# EAGLE schematic dci (EAGLE 9.0.0)

## Sheet 1 of 2
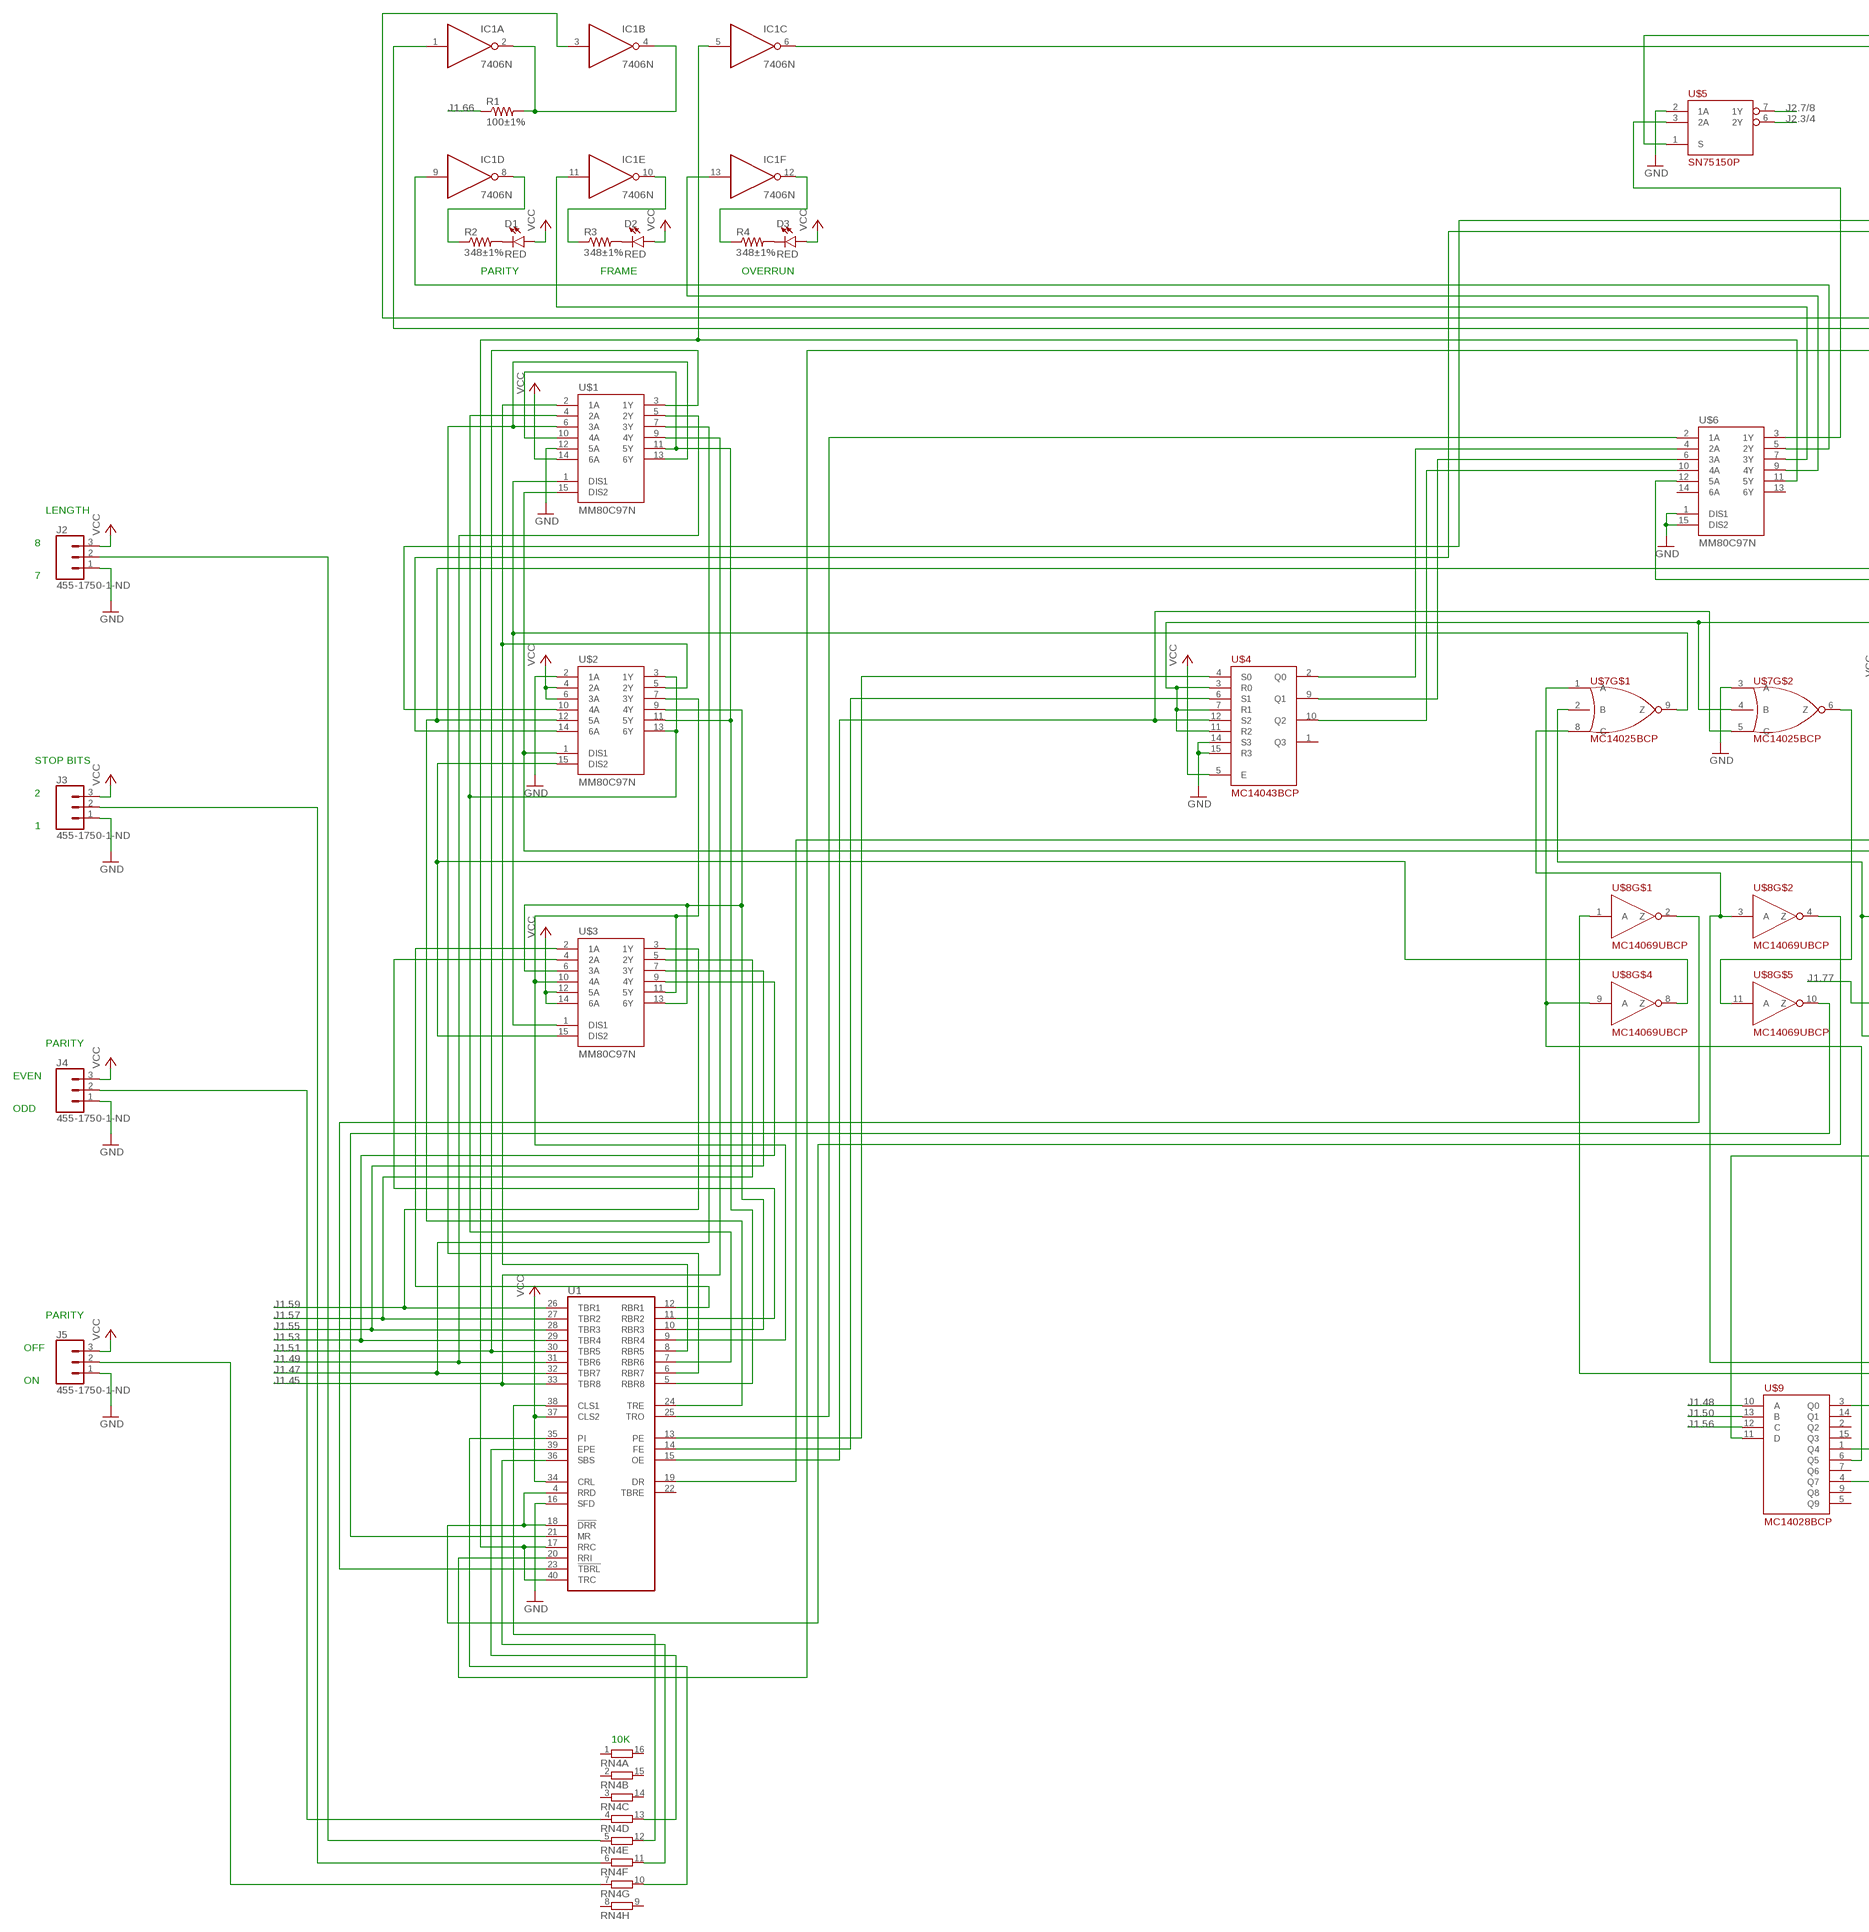
[diagram p0: schematic, sheet 1, part 1 of 2]
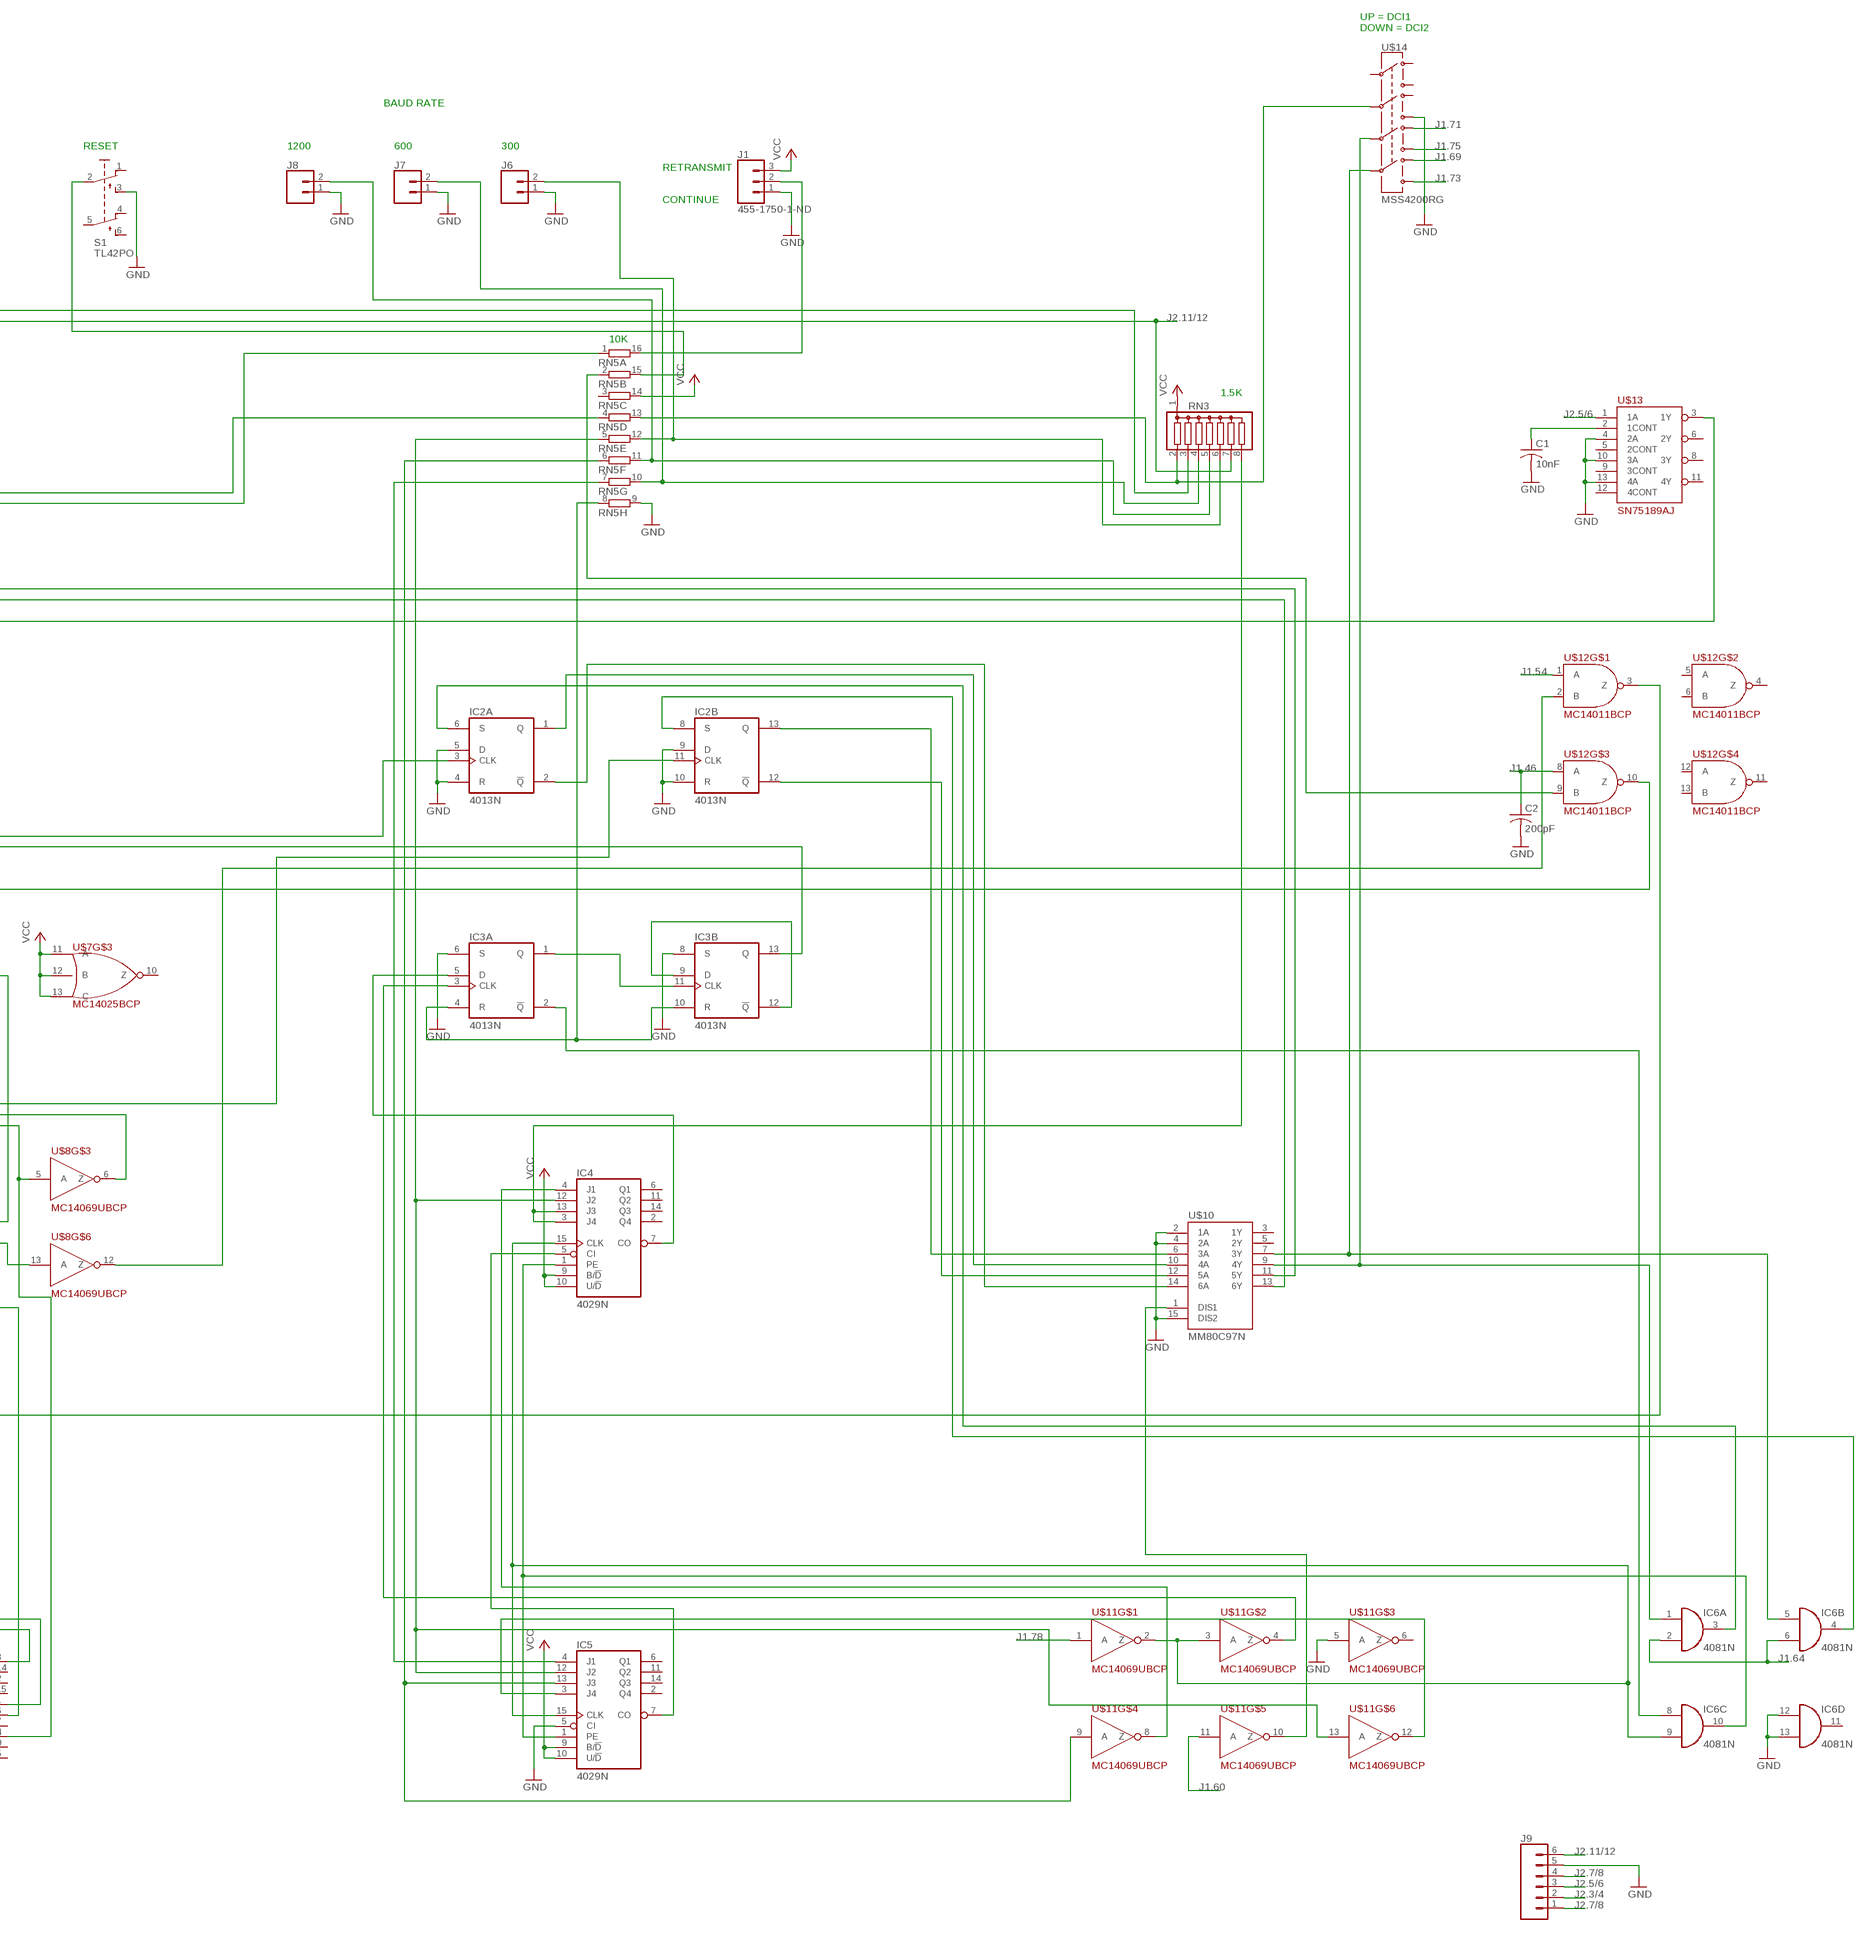
[diagram p1: schematic, sheet 1, part 2 of 2]

### Parts
C1  10nF  C-US050-024X044  [C050-024X044]
C2  200pF  C-US050-024X044  [C050-024X044]
D1  RED  LED3MM  [LED_3MM]
D2  RED  LED3MM  [LED_3MM]
D3  RED  LED3MM  [LED_3MM]
IC1  7406N  [DIL14]
IC2  4013N  [DIL14]
IC3  4013N  [DIL14]
IC4  4029N  [DIL16]
IC5  4029N  [DIL16]
IC6  4081N  [DIL14]
J1  455-1750-1-ND  CONN_03  [1X03]
J2  455-1750-1-ND  CONN_03  [1X03]
J3  455-1750-1-ND  CONN_03  [1X03]
J4  455-1750-1-ND  CONN_03  [1X03]
J5  455-1750-1-ND  CONN_03  [1X03]
J6  CONN_02  [1X02]
J7  CONN_02  [1X02]
J8  CONN_02  [1X02]
J9  CONN_06SILK_FEMALE_PTH  [1X06]
R1  100±1%  R-US_0207/7  [0207/7]
R2  348±1%  R-US_0207/7  [0207/7]
R3  348±1%  R-US_0207/7  [0207/7]
R4  348±1%  R-US_0207/7  [0207/7]
RN3  G07R  [SIL8]
RN4  8R-N  [DIL16]
RN5  8R-N  [DIL16]
S1  TL42PO  [TL4XPO]
U1  HD6402  [DIL40]
U$1  MM80C97N  [DIL16]
U$2  MM80C97N  [DIL16]
U$3  MM80C97N  [DIL16]
U$4  MC14043BCP  [DIL16]
U$5  SN75150P  [DIL08]
U$6  MM80C97N  [DIL16]
U$7  MC14025BCP  [DIL14]
U$8  MC14069UBCP  [DIL14]
U$9  MC14028BCP  [DIL16]
U$10  MM80C97N  [DIL16]
U$11  MC14069UBCP  [DIL14]
U$12  MC14011BCP  [DIL14]
U$13  SN75189AJ  [DIL14]
U$14  MSS4200RG  [MSS4200RG]

### Nets
GND: C1.2 C2.2 IC2.4(A:R) IC2.5(A:D) IC2.9(B:D) IC2.10(B:R) IC3.6(A:S) IC3.8(B:S) IC5.5(CI) IC6.12(D:I0) IC6.13(D:I1) J1.1 J2.1 J3.1 J4.1 J5.1 J6.1 J7.1 J8.1 J9.5 RN5.9 S1.3(S) U1.16(SFD) U$1.12(5A) U$2.2(1A) U$4.14(S3) U$4.15(R3) U$5.2(1A) U$6.1(DIS1) U$6.15(DIS2) U$7.3(A) U$10.2(1A) U$10.4(2A) U$10.15(DIS2) U$11.5(A) U$13.4(2A) U$13.10(3A) U$13.13(4A) U$14.6 ; also sheet 2
J1.45: U1.33(TBR8) U$1.9(4Y)
J1.46: C2.1 U$12.8(A)
J1.47: U1.32(TBR7) U$1.7(3Y)
J1.48: U$9.10(A)
J1.49: U1.31(TBR6) U$1.5(2Y)
J1.50: U$9.13(B)
J1.51: U1.30(TBR5) U$1.3(1Y)
J1.53: U1.29(TBR4) U$3.9(4Y)
J1.54: U$12.1(A)
J1.55: U1.28(TBR3) U$3.7(3Y)
J1.56: U$9.12(C)
J1.57: U1.27(TBR2) U$3.5(2Y)
J1.59: U1.26(TBR1) U$3.3(1Y)
J1.60: U$11.11(A)
J1.64: IC6.2(A:I1) IC6.6(B:I1)
J1.66: R1.1
J1.69: U$14.10
J1.71: U$14.7
J1.73: U$14.12
J1.75: U$14.9
J1.77: U$8.13(A)
J1.78: U$11.1(A)
J2.3/4: J9.2 U$5.6(2Y) ; also sheet 2
J2.5/6: J9.3 U$13.1(1A) ; also sheet 2
J2.7/8: J9.1 J9.4 U$5.7(1Y) ; also sheet 2
J2.11/12: IC1.6(C:O) J9.6 RN3.7 ; also sheet 2
N$1: IC1.2(A:O) IC1.4(B:O) R1.2
N$2: U1.6(RBR7) U$1.6(3A) U$1.13(6Y)
N$3: U1.7(RBR6) U$1.4(2A) U$2.3(1Y) U$2.13(6Y)
N$4: U1.5(RBR8) U$1.10(4A) U$1.11(5Y) U$2.11(5Y)
N$5: IC1.1(A:I) U$10.13(6Y)
N$6: U1.10(RBR3) U$2.9(4Y) U$3.6(3A) U$3.13(6Y)
N$7: U1.9(RBR4) U$2.7(3Y) U$3.10(4A) U$3.11(5Y)
N$8: IC3.9(B:D) IC3.12(B:!Q)
N$9: IC4.3(J4) IC4.13(J3) RN3.8
N$10: IC1.3(B:I) U$10.11(5Y)
N$11: U1.4(RRD) U1.18(!DRR) U$8.4(Z)
N$12: IC1.5(C:I) U1.17(RRC) U1.40(TRC) U$6.11(5Y)
N$13: U$4.3(R0) U$4.7(R1) U$4.11(R2) U$7.4(B) U$12.10(Z)
N$14: D1.K(C) R2.2
N$15: IC1.8(D:O) R2.1
N$16: IC1.9(D:I) U$6.5(2Y)
N$17: IC4.15(CLK) IC5.15(CLK) IC6.9(C:I1) U$11.2(Z) U$11.3(A)
N$18: U$7.2(B) U$8.5(A) U$9.4(Q7)
N$19: D2.K(C) R3.2
N$20: U$5.3(2A) U$6.3(1Y)
N$21: IC1.10(E:O) R3.1
N$22: IC2.11(B:CLK) U1.19(DR)
N$23: IC3.4(A:R) IC3.10(B:R) RN5.8
N$24: IC1.11(E:I) U$6.7(3Y)
N$25: D3.K(C) R4.2
N$26: IC1.12(F:O) R4.1
N$27: IC1.13(F:I) U$6.9(4Y)
N$28: U$1.1(DIS1) U$3.1(DIS1) U$7.9(Z)
N$29: IC3.13(B:Q) U$6.12(5A)
N$30: U1.8(RBR5) U$1.2(1A) U$2.5(2Y)
N$31: RN5.1 U$2.14(6A)
N$32: U$4.9(Q1) U$6.6(3A)
N$33: U$1.15(DIS2) U$2.1(DIS1) U$8.6(Z)
N$34: U$4.10(Q2) U$6.10(4A)
N$35: RN5.4 U$2.10(4A)
N$36: U$7.1(A) U$8.9(A) U$9.6(Q5)
N$37: RN3.2 RN5.13 U$14.5
N$38: J1.2 RN5.16
N$39: IC2.3(A:CLK) U1.24(TRE) U$2.12(5A)
N$40: U$7.6(Z) U$8.11(A)
N$41: U$4.2(Q0) U$6.4(2A)
N$42: U1.12(RBR1) U$3.2(1A)
N$43: U$7.8(C) U$8.3(A) U$9.1(Q4)
N$44: U$2.15(DIS2) U$3.15(DIS2) U$8.8(Z)
N$45: U1.11(RBR2) U$3.4(2A)
N$46: RN3.3 U$5.1(S)
N$47: J2.2 RN4.5
N$48: J3.2 RN4.6
N$49: RN4.11 U1.36(SBS)
N$50: J4.2 RN4.4
N$51: RN4.12 U1.38(CLS1)
N$52: RN4.13 U1.39(EPE)
N$53: J5.2 RN4.7
N$54: RN4.10 U1.35(PI)
N$55: U1.20(RRI) U$13.3(1Y)
N$56: U1.21(MR) U$8.10(Z)
N$57: U1.23(!TBRL) U$8.2(Z)
N$58: U$8.1(A) U$9.3(Q0)
N$59: U1.25(TRO) U$6.2(1A)
N$60: U1.15(OE) U$4.12(S2) U$7.5(C)
N$61: U1.14(FE) U$4.6(S1)
N$62: U1.13(PE) U$4.4(S0)
N$63: U$8.12(Z) U$12.2(B)
N$64: U$9.11(D) U$12.3(Z)
N$65: RN5.15 S1.2(P)
N$66: RN5.2 U$12.9(B)
N$67: C1.1 U$13.2(1CONT)
N$68: J8.2 RN3.5 RN5.11
N$69: J7.2 RN3.4 RN5.10
N$70: J6.2 RN3.6 RN5.12
N$71: IC4.12(J2) IC5.12(J2) RN5.5 U$11.13(A)
N$72: IC5.13(J3) RN5.6 U$11.9(A)
N$73: IC5.4(J1) RN5.7
N$74: IC2.13(B:Q) U$10.6(3A)
N$75: IC3.2(A:!Q) IC6.8(C:I0)
N$76: IC2.1(A:Q) U$10.10(4A)
N$77: IC2.2(A:!Q) U$10.14(6A)
N$78: IC2.6(A:S) IC6.3(A:O)
N$79: IC2.8(B:S) IC6.4(B:O)
N$80: IC2.12(B:!Q) U$10.12(5A)
N$81: IC3.3(A:CLK) U$11.4(Z)
N$82: IC3.5(A:D) IC4.7(CO)
N$83: IC4.1(PE) IC5.1(PE) IC6.10(C:O)
N$84: IC4.4(J1) U$11.8(Z)
N$85: IC4.5(CI) IC5.7(CO)
N$86: IC5.3(J4) U$11.12(Z)
N$87: U$10.1(DIS1) U$11.10(Z)
N$88: IC6.5(B:I0) U$10.7(3Y) U$14.11
N$89: IC6.1(A:I0) U$10.9(4Y) U$14.8
N$102: IC3.1(A:Q) IC3.11(B:CLK)
VCC: D1.A D2.A D3.A IC4.9(B/!D) IC4.10(U/!D) IC5.9(B/!D) IC5.10(U/!D) J1.3 J2.3 J3.3 J4.3 J5.3 RN3.1 RN5.14 U1.34(CRL) U1.37(CLS2) U$1.14(6A) U$2.4(2A) U$2.6(3A) U$3.12(5A) U$3.14(6A) U$4.5(E) U$7.11(A) U$7.12(B) U$7.13(C) ; also sheet 2
Unconnected: IC4.2(Q4) IC4.6(Q1) IC4.11(Q2) IC4.14(Q3) IC5.2(Q4) IC5.6(Q1) IC5.11(Q2) IC5.14(Q3) IC6.11(D:O) RN4.1 RN4.2 RN4.3 RN4.8 RN4.9 RN4.14 RN4.15 RN4.16 RN5.3 S1.1(O) S1.4(O1) S1.5(P1) S1.6(S1) U1.22(TBRE) U$4.1(Q3) U$6.13(6Y) U$6.14(6A) U$7.10(Z) U$9.2(Q2) U$9.5(Q9) U$9.7(Q6) U$9.9(Q8) U$9.14(Q1) U$9.15(Q3) U$10.3(1Y) U$10.5(2Y) U$11.6(Z) U$12.4(Z) U$12.5(A) U$12.6(B) U$12.11(Z) U$12.12(A) U$12.13(B) U$13.5(2CONT) U$13.6(2Y) U$13.8(3Y) U$13.9(3CONT) U$13.11(4Y) U$13.12(4CONT) U$14.1 U$14.2 U$14.3 U$14.4

### Notes on the sheet
- UP = DCI1
  DOWN = DCI2
- BAUD RATE
- RESET | 1200 | 600 | 300
- RETRANSMIT
- CONTINUE
- 10K
- 1.5K
- PARITY | FRAME | OVERRUN
- LENGTH
- 8
- 7
- STOP BITS
- 2
- 1
- PARITY
- EVEN
- ODD
- PARITY
- OFF
- ON
- 10K

## Sheet 2 of 2
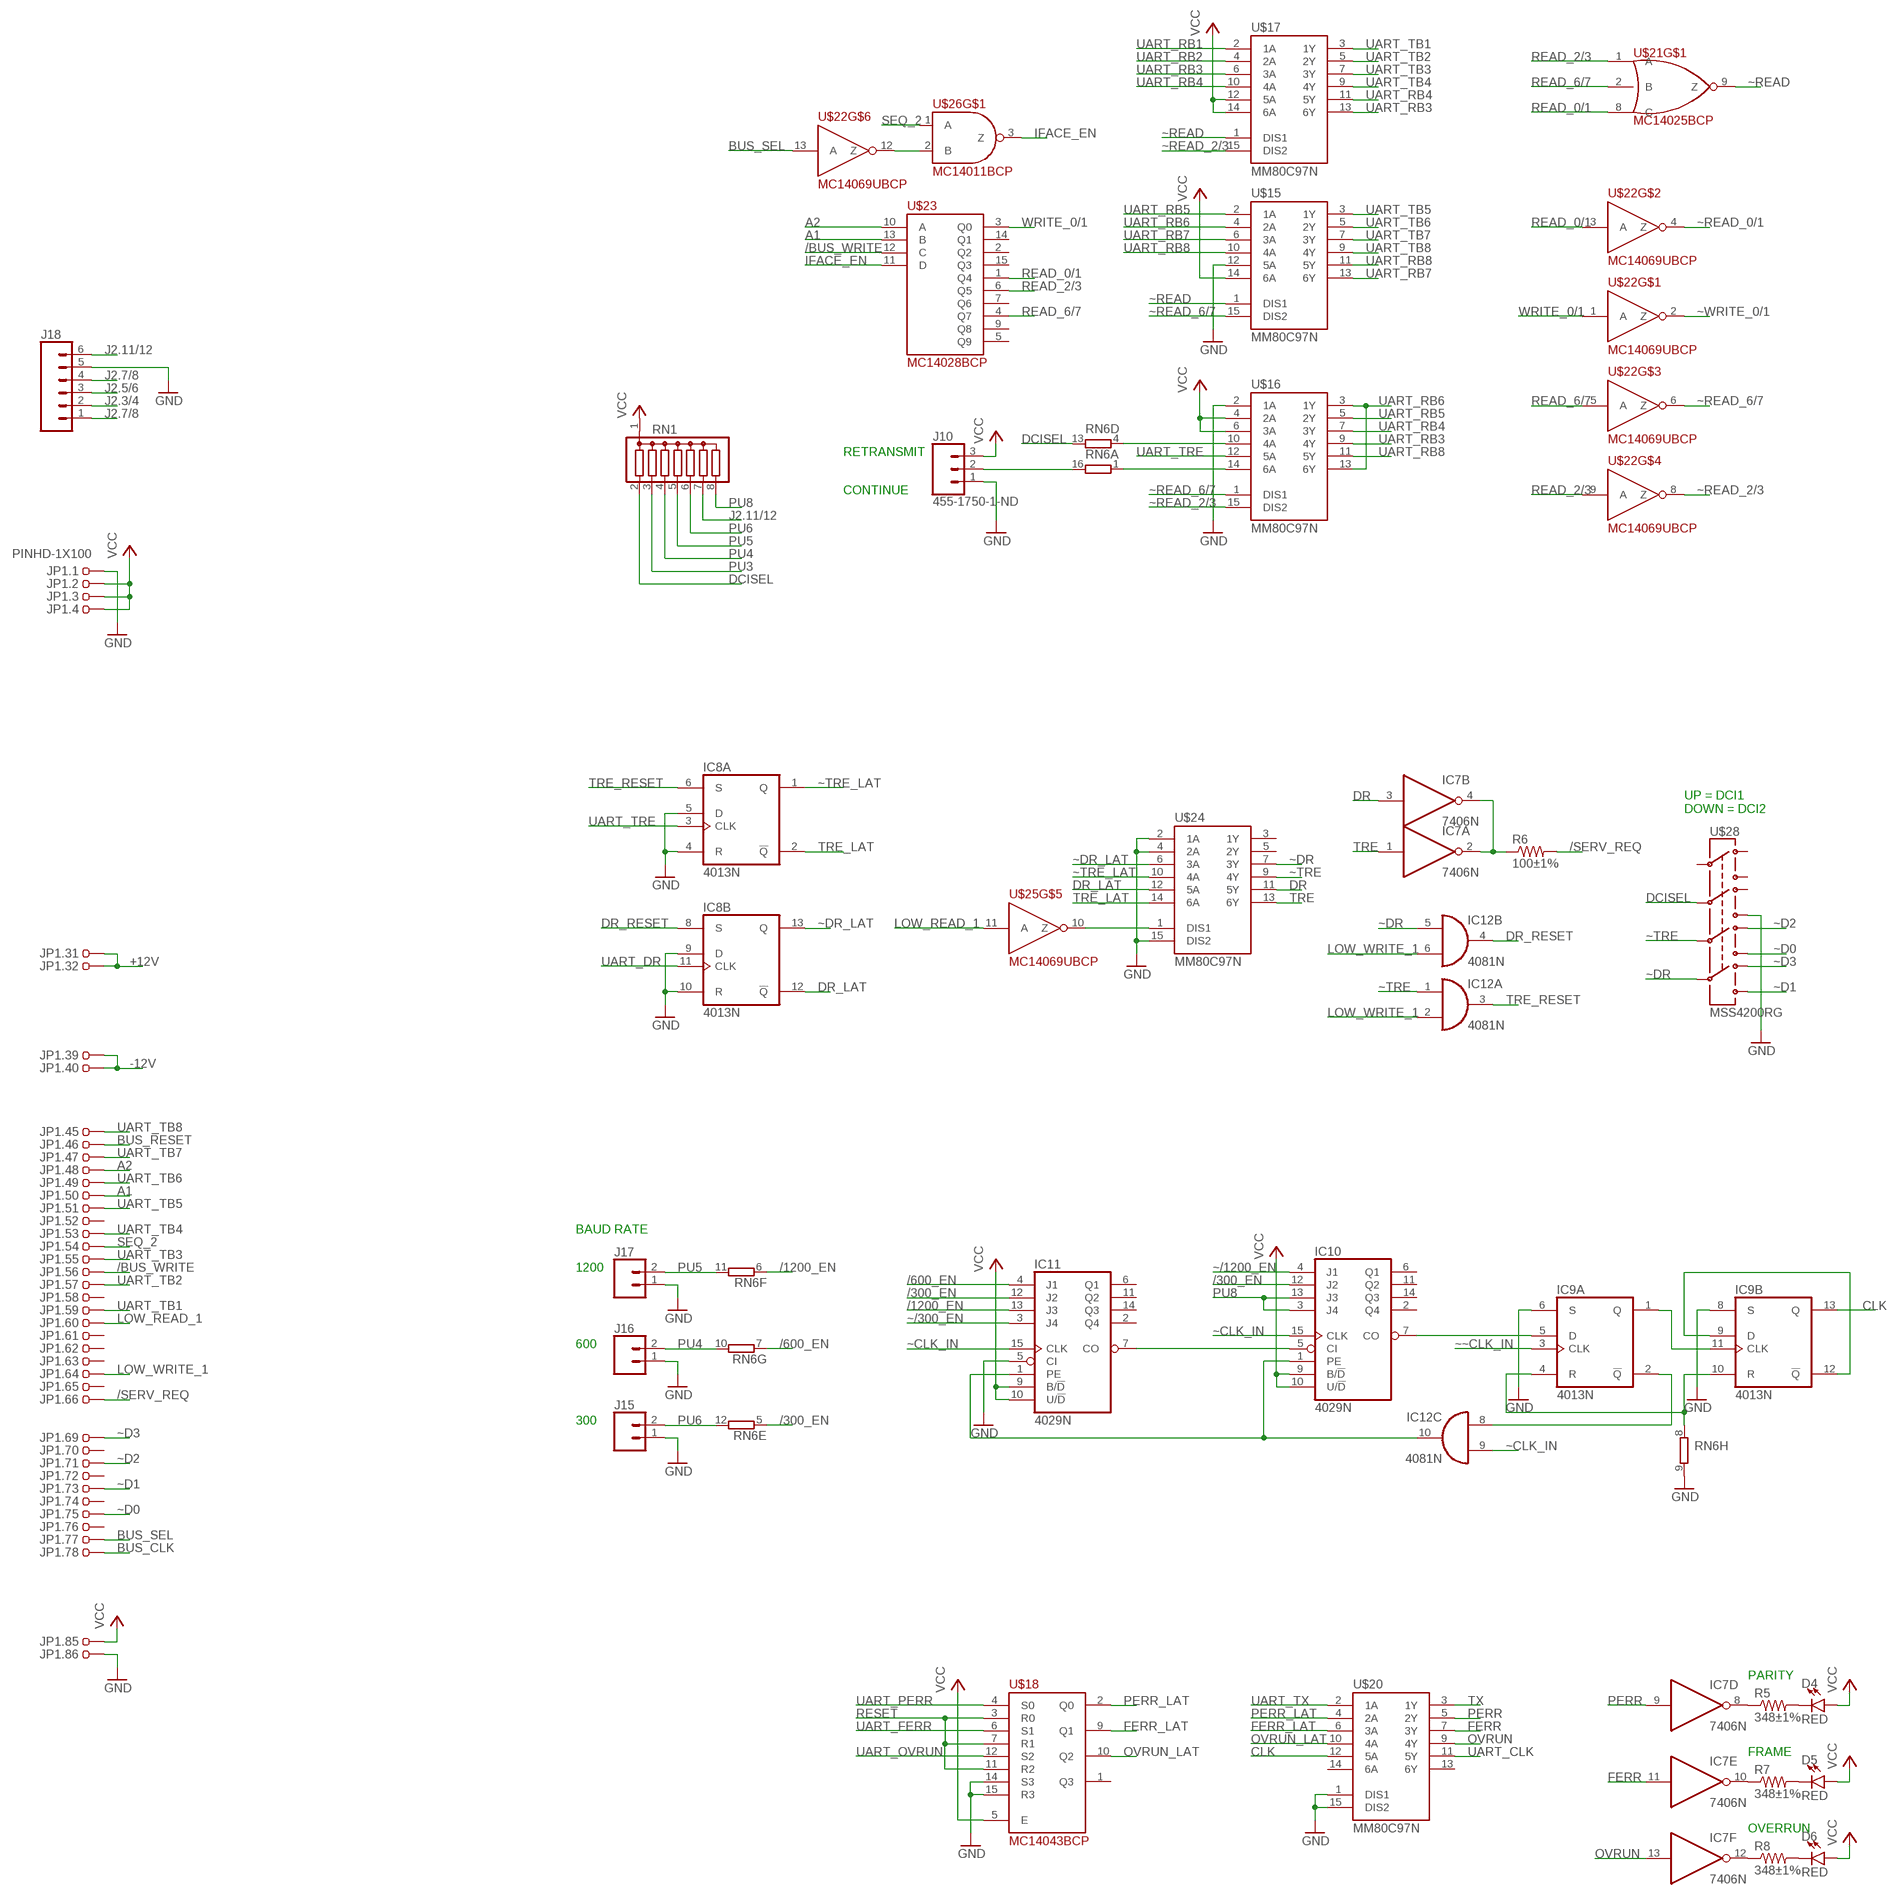
[diagram p2: schematic, sheet 2, part 1 of 2]
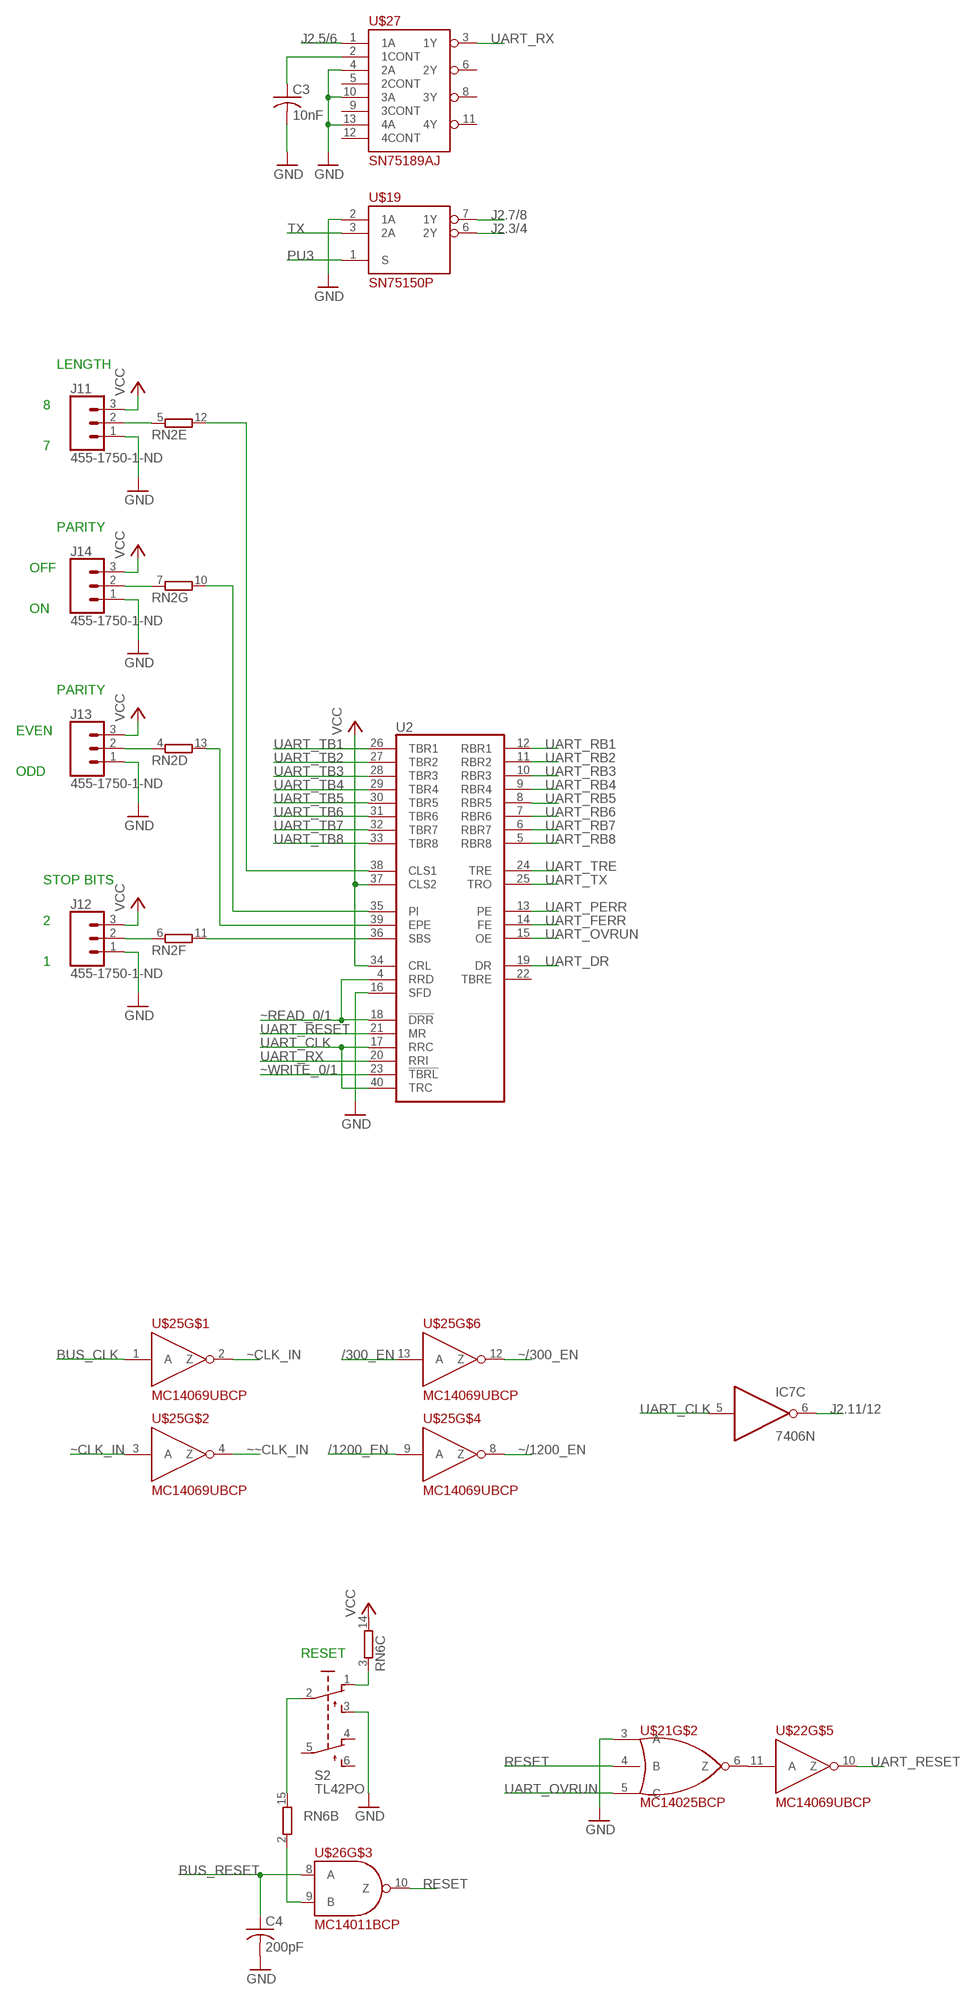
[diagram p3: schematic, sheet 2, part 2 of 2]

### Parts
C3  10nF  C-US050-024X044  [C050-024X044]
C4  200pF  C-US050-024X044  [C050-024X044]
D4  RED  LED3MM  [LED_3MM]
D5  RED  LED3MM  [LED_3MM]
D6  RED  LED3MM  [LED_3MM]
IC7  7406N  [DIL14]
IC8  4013N  [DIL14]
IC9  4013N  [DIL14]
IC10  4029N  [DIL16]
IC11  4029N  [DIL16]
IC12  4081N  [DIL14]
J10  455-1750-1-ND  CONN_03  [1X03]
J11  455-1750-1-ND  CONN_03  [1X03]
J12  455-1750-1-ND  CONN_03  [1X03]
J13  455-1750-1-ND  CONN_03  [1X03]
J14  455-1750-1-ND  CONN_03  [1X03]
J15  CONN_02  [1X02]
J16  CONN_02  [1X02]
J17  CONN_02  [1X02]
J18  CONN_06SILK_FEMALE_PTH  [1X06]
JP1  PINHD-1X100  [1X100]
R5  348±1%  R-US_0207/7  [0207/7]
R6  100±1%  R-US_0207/7  [0207/7]
R7  348±1%  R-US_0207/7  [0207/7]
R8  348±1%  R-US_0207/7  [0207/7]
RN1  G07R  [SIL8]
RN2  8R-N  [DIL16]
RN6  8R-N  [DIL16]
S2  TL42PO  [TL4XPO]
U2  HD6402  [DIL40]
U$15  MM80C97N  [DIL16]
U$16  MM80C97N  [DIL16]
U$17  MM80C97N  [DIL16]
U$18  MC14043BCP  [DIL16]
U$19  SN75150P  [DIL08]
U$20  MM80C97N  [DIL16]
U$21  MC14025BCP  [DIL14]
U$22  MC14069UBCP  [DIL14]
U$23  MC14028BCP  [DIL16]
U$24  MM80C97N  [DIL16]
U$25  MC14069UBCP  [DIL14]
U$26  MC14011BCP  [DIL14]
U$27  SN75189AJ  [DIL14]
U$28  MSS4200RG  [MSS4200RG]

### Nets
+12V: JP1.31 JP1.32
-12V: JP1.39 JP1.40
/300_EN: IC10.12(J2) IC11.12(J2) RN6.5 U$25.13(A)
/600_EN: IC11.4(J1) RN6.7
/1200_EN: IC11.13(J3) RN6.6 U$25.9(A)
/BUS_WRITE: JP1.56 U$23.12(C)
/SERV_REQ: JP1.66 R6.2
A1: JP1.50 U$23.13(B)
A2: JP1.48 U$23.10(A)
BUS_CLK: JP1.78 U$25.1(A)
BUS_RESET: C4.1 JP1.46 U$26.8(A)
BUS_SEL: JP1.77 U$22.13(A)
CLK: IC9.13(B:Q) U$20.12(5A)
DCISEL: RN1.2 RN6.13 U$28.5
DR: IC7.3(B:I) U$24.11(5Y)
DR_LAT: IC8.12(B:!Q) U$24.12(5A)
DR_RESET: IC8.8(B:S) IC12.4(B:O)
FERR: IC7.11(E:I) U$20.7(3Y)
FERR_LAT: U$18.9(Q1) U$20.6(3A)
GND: C3.2 C4.2 IC8.4(A:R) IC8.5(A:D) IC8.9(B:D) IC8.10(B:R) IC9.6(A:S) IC9.8(B:S) IC11.5(CI) J10.1 J11.1 J12.1 J13.1 J14.1 J15.1 J16.1 J17.1 J18.5 JP1.1 JP1.86 RN6.9 S2.3(S) U2.16(SFD) U$15.12(5A) U$16.2(1A) U$18.14(S3) U$18.15(R3) U$19.2(1A) U$20.1(DIS1) U$20.15(DIS2) U$21.3(A) U$24.2(1A) U$24.4(2A) U$24.15(DIS2) U$27.4(2A) U$27.10(3A) U$27.13(4A) U$28.6 ; also sheet 1
IFACE_EN: U$23.11(D) U$26.3(Z)
J2.3/4: J18.2 U$19.6(2Y) ; also sheet 1
J2.5/6: J18.3 U$27.1(1A) ; also sheet 1
J2.7/8: J18.1 J18.4 U$19.7(1Y) ; also sheet 1
J2.11/12: IC7.6(C:O) J18.6 RN1.7 ; also sheet 1
LOW_READ_1: JP1.60 U$25.11(A)
LOW_WRITE_1: IC12.2(A:I1) IC12.6(B:I1) JP1.64
N$90: RN2.10 U2.35(PI)
N$91: RN6.3 S2.1(O)
N$99: IC9.4(A:R) IC9.10(B:R) RN6.8
N$100: IC9.9(B:D) IC9.12(B:!Q)
N$101: IC9.1(A:Q) IC9.11(B:CLK)
N$105: D4.K(C) R5.2
N$106: IC7.8(D:O) R5.1
N$107: D5.K(C) R7.2
N$108: IC7.10(E:O) R7.1
N$110: D6.K(C) R8.2
N$111: IC7.12(F:O) R8.1
N$117: RN6.4 U$16.10(4A)
N$120: RN6.1 U$16.14(6A)
N$121: J10.2 RN6.16
N$125: J11.2 RN2.5
N$126: RN2.12 U2.38(CLS1)
N$127: J12.2 RN2.6
N$128: RN2.11 U2.36(SBS)
N$129: J13.2 RN2.4
N$130: RN2.13 U2.39(EPE)
N$131: J14.2 RN2.7
N$147: U$21.6(Z) U$22.11(A)
N$150: U$22.12(Z) U$26.2(B)
N$155: RN6.15 S2.2(P)
N$156: RN6.2 U$26.9(B)
N$158: IC10.1(PE) IC11.1(PE) IC12.10(C:O)
N$166: IC9.2(A:!Q) IC12.8(C:I0)
N$168: IC9.5(A:D) IC10.7(CO)
N$171: IC10.5(CI) IC11.7(CO)
N$173: U$24.1(DIS1) U$25.10(Z)
N$176: C3.1 U$27.2(1CONT)
N$177: IC7.2(A:O) IC7.4(B:O) R6.1
OVRUN: IC7.13(F:I) U$20.9(4Y)
OVRUN_LAT: U$18.10(Q2) U$20.10(4A)
PERR: IC7.9(D:I) U$20.5(2Y)
PERR_LAT: U$18.2(Q0) U$20.4(2A)
PU3: RN1.3 U$19.1(S)
PU4: J16.2 RN1.4 RN6.10
PU5: J17.2 RN1.5 RN6.11
PU6: J15.2 RN1.6 RN6.12
PU8: IC10.3(J4) IC10.13(J3) RN1.8
READ_0/1: U$21.8(C) U$22.3(A) U$23.1(Q4)
READ_2/3: U$21.1(A) U$22.9(A) U$23.6(Q5)
READ_6/7: U$21.2(B) U$22.5(A) U$23.4(Q7)
RESET: U$18.3(R0) U$18.7(R1) U$18.11(R2) U$21.4(B) U$26.10(Z)
SEQ_2: JP1.54 U$26.1(A)
TRE: IC7.1(A:I) U$24.13(6Y)
TRE_LAT: IC8.2(A:!Q) U$24.14(6A)
TRE_RESET: IC8.6(A:S) IC12.3(A:O)
TX: U$19.3(2A) U$20.3(1Y)
UART_CLK: IC7.5(C:I) U2.17(RRC) U2.40(TRC) U$20.11(5Y)
UART_DR: IC8.11(B:CLK) U2.19(DR)
UART_FERR: U2.14(FE) U$18.6(S1)
UART_OVRUN: U2.15(OE) U$18.12(S2) U$21.5(C)
UART_PERR: U2.13(PE) U$18.4(S0)
UART_RB1: U2.12(RBR1) U$17.2(1A)
UART_RB2: U2.11(RBR2) U$17.4(2A)
UART_RB3: U2.10(RBR3) U$16.9(4Y) U$17.6(3A) U$17.13(6Y)
UART_RB4: U2.9(RBR4) U$16.7(3Y) U$17.10(4A) U$17.11(5Y)
UART_RB5: U2.8(RBR5) U$15.2(1A) U$16.5(2Y)
UART_RB6: U2.7(RBR6) U$15.4(2A) U$16.3(1Y) U$16.13(6Y)
UART_RB7: U2.6(RBR7) U$15.6(3A) U$15.13(6Y)
UART_RB8: U2.5(RBR8) U$15.10(4A) U$15.11(5Y) U$16.11(5Y)
UART_RESET: U2.21(MR) U$22.10(Z)
UART_RX: U2.20(RRI) U$27.3(1Y)
UART_TB1: JP1.59 U2.26(TBR1) U$17.3(1Y)
UART_TB2: JP1.57 U2.27(TBR2) U$17.5(2Y)
UART_TB3: JP1.55 U2.28(TBR3) U$17.7(3Y)
UART_TB4: JP1.53 U2.29(TBR4) U$17.9(4Y)
UART_TB5: JP1.51 U2.30(TBR5) U$15.3(1Y)
UART_TB6: JP1.49 U2.31(TBR6) U$15.5(2Y)
UART_TB7: JP1.47 U2.32(TBR7) U$15.7(3Y)
UART_TB8: JP1.45 U2.33(TBR8) U$15.9(4Y)
UART_TRE: IC8.3(A:CLK) U2.24(TRE) U$16.12(5A)
UART_TX: U2.25(TRO) U$20.2(1A)
VCC: D4.A D5.A D6.A IC10.9(B/!D) IC10.10(U/!D) IC11.9(B/!D) IC11.10(U/!D) J10.3 J11.3 J12.3 J13.3 J14.3 JP1.2 JP1.3 JP1.4 JP1.85 RN1.1 RN6.14 U2.34(CRL) U2.37(CLS2) U$15.14(6A) U$16.4(2A) U$16.6(3A) U$17.12(5A) U$17.14(6A) U$18.5(E) ; also sheet 1
WRITE_0/1: U$22.1(A) U$23.3(Q0)
~/300_EN: IC11.3(J4) U$25.12(Z)
~/1200_EN: IC10.4(J1) U$25.8(Z)
~CLK_IN: IC10.15(CLK) IC11.15(CLK) IC12.9(C:I1) U$25.2(Z) U$25.3(A)
~D0: JP1.75 U$28.9
~D1: JP1.73 U$28.12
~D2: JP1.71 U$28.7
~D3: JP1.69 U$28.10
~DR: IC12.5(B:I0) U$24.7(3Y) U$28.11
~DR_LAT: IC8.13(B:Q) U$24.6(3A)
~READ: U$15.1(DIS1) U$17.1(DIS1) U$21.9(Z)
~READ_0/1: U2.4(RRD) U2.18(!DRR) U$22.4(Z)
~READ_2/3: U$16.15(DIS2) U$17.15(DIS2) U$22.8(Z)
~READ_6/7: U$15.15(DIS2) U$16.1(DIS1) U$22.6(Z)
~TRE: IC12.1(A:I0) U$24.9(4Y) U$28.8
~TRE_LAT: IC8.1(A:Q) U$24.10(4A)
~WRITE_0/1: U2.23(!TBRL) U$22.2(Z)
~~CLK_IN: IC9.3(A:CLK) U$25.4(Z)
Unconnected: IC10.2(Q4) IC10.6(Q1) IC10.11(Q2) IC10.14(Q3) IC11.2(Q4) IC11.6(Q1) IC11.11(Q2) IC11.14(Q3) IC12.11(D:O) IC12.12(D:I0) IC12.13(D:I1) JP1.5 JP1.6 JP1.7 JP1.8 JP1.9 JP1.10 JP1.11 JP1.12 JP1.13 JP1.14 JP1.15 JP1.16 JP1.17 JP1.18 JP1.19 JP1.20 JP1.21 JP1.22 JP1.23 JP1.24 JP1.25 JP1.26 JP1.27 JP1.28 JP1.29 JP1.30 JP1.33 JP1.34 JP1.35 JP1.36 JP1.37 JP1.38 JP1.41 JP1.42 JP1.43 JP1.44 JP1.52 JP1.58 JP1.61 JP1.62 JP1.63 JP1.65 JP1.67 JP1.68 JP1.70 JP1.72 JP1.74 JP1.76 JP1.79 JP1.80 JP1.81 JP1.82 JP1.83 JP1.84 JP1.87 JP1.88 JP1.89 JP1.90 JP1.91 JP1.92 JP1.93 JP1.94 JP1.95 JP1.96 JP1.97 JP1.98 JP1.99 JP1.100 RN2.1 RN2.2 RN2.3 RN2.8 RN2.9 RN2.14 RN2.15 RN2.16 S2.4(O1) S2.5(P1) S2.6(S1) U2.22(TBRE) U$18.1(Q3) U$20.13(6Y) U$20.14(6A) U$21.10(Z) U$21.11(A) U$21.12(B) U$21.13(C) U$23.2(Q2) U$23.5(Q9) U$23.7(Q6) U$23.9(Q8) U$23.14(Q1) U$23.15(Q3) U$24.3(1Y) U$24.5(2Y) U$25.5(A) U$25.6(Z) U$26.4(Z) U$26.5(A) U$26.6(B) U$26.11(Z) U$26.12(A) U$26.13(B) U$27.5(2CONT) U$27.6(2Y) U$27.8(3Y) U$27.9(3CONT) U$27.11(4Y) U$27.12(4CONT) U$28.1 U$28.2 U$28.3 U$28.4

### Notes on the sheet
- LENGTH
- 8
- RETRANSMIT
- 7
- CONTINUE
- PARITY
- OFF
- ON
- PARITY
- EVEN
- ODD
- UP = DCI1
  DOWN = DCI2
- STOP BITS
- 2
- 1
- BAUD RATE
- 1200
- 600
- 300
- RESET
- PARITY
- FRAME
- OVERRUN

## Power pins joined to a net without a drawn wire
GND: IC1.7(P:GND) IC7.7(P:GND) U1.3(GND) U2.3(GND)
VCC: IC1.14(P:VCC) IC7.14(P:VCC) U1.1(VCC) U2.1(VCC)
VDD: IC2.14(P:VDD) IC3.14(P:VDD) IC4.16(VDD) IC5.16(VDD) IC6.14(P:VDD) IC8.14(P:VDD) IC9.14(P:VDD) IC10.16(VDD) IC11.16(VDD) IC12.14(P:VDD)
VSS: IC2.7(P:VSS) IC3.7(P:VSS) IC4.8(VSS) IC5.8(VSS) IC6.7(P:VSS) IC8.7(P:VSS) IC9.7(P:VSS) IC10.8(VSS) IC11.8(VSS) IC12.7(P:VSS)

## Library data of the parts
C1-C4 = resistor:C-US: CAPACITOR, American symbol
D1-D6 = SparkFun-LED:LED: LED (Generic) Standard schematic elements and footprints for 5mm, 3mm, 1206, and 0603 sized LEDs. Generic LEDs with no color specified.; PROD_ID: DIO-08794
IC1 IC7 = 74xx-us:74*06: Hex INVERTER, open collector high-voltage output
IC2 IC3 IC8 IC9 = 40xx:4013: Dual D FLIP FLOP, set/reset
IC4 IC5 IC10 IC11 = 40xx:4029: Binary/decimal up/down COUNTER
IC6 IC12 = 40xx:4081: Quad 2-input AND
J1-J5 J10-J14 = SparkFun-Connectors:CONN_03: Multi connection point. Often used as Generic Header-pin footprint for 0.1 inch spaced/style header connections On any of the 0.1 inch spaced packages, you can populate with these: Break Away Headers - Straight <https://www.sparkfun.com/products/116> (PRT-00116) Break Away Male Headers - Right Angle <https://www.sparkfun.com/products/553> (PRT-00553) Female Headers <https://www.sparkfun.com/products/115> (PRT-00115) Break Away Headers - Machine Pin <https://www.sparkfun.com/products/117> (PRT-00117) Break Away Female Headers - Swiss Machine Pin <https://www.sparkfun.com/products/743> (PRT-00743) Stackable Header - 3 Pin (Female, 0.1") <https://www.sparkfun.com/products/13875> (PRT-13875) For SCREWTERMINALS and SPRING TERMINALS visit here: Screw Terimnals on SparkFun.com <https://www.sparkfun.com/search/results?term=Screw+Terminals> (5mm/3.5mm/2.54mm spacing) This device is also useful as a general connection point to wire up your design to another part of your project. Our various solder wires solder well into these plated through hole pads. Hook-Up Wire - Assortment (Stranded, 22 AWG) <https://www.sparkfun.com/products/11375> (PRT-11375) Hook-Up Wire - Assortment (Solid Core, 22 AWG) <https://www.sparkfun.com/products/11367> (PRT-11367) View the entire wire category on our website here <https://www.sparkfun.com/categories/141> Special notes: Molex polarized connector foot print use with SKU : PRT-08232 with associated crimp pins and housings.; PROD_ID: XXX-00000
J6-J8 J15-J17 = SparkFun-Connectors:CONN_02: Multi connection point. Often used as Generic Header-pin footprint for 0.1 inch spaced/style header connections On any of the 0.1 inch spaced packages, you can populate with these: Break Away Headers - Straight <https://www.sparkfun.com/products/116> (PRT-00116) Break Away Male Headers - Right Angle <https://www.sparkfun.com/products/553> (PRT-00553) Female Headers <https://www.sparkfun.com/products/115> (PRT-00115) Break Away Headers - Machine Pin <https://www.sparkfun.com/products/117> (PRT-00117) Break Away Female Headers - Swiss Machine Pin <https://www.sparkfun.com/products/743> (PRT-00743) For SCREWTERMINALS and SPRING TERMINALS visit here: Screw Terimnals on SparkFun.com <https://www.sparkfun.com/search/results?term=Screw+Terminals> (5mm/3.5mm/2.54mm spacing) This device is also useful as a general connection point to wire up your design to another part of your project. Our various solder wires solder well into these plated through hole pads. Hook-Up Wire - Assortment (Stranded, 22 AWG) <https://www.sparkfun.com/products/11375> (PRT-11375) Hook-Up Wire - Assortment (Solid Core, 22 AWG) <https://www.sparkfun.com/products/11367> (PRT-11367) View the entire wire category on our website here <https://www.sparkfun.com/categories/141> Special notes: Molex polarized connector foot print use with: PRT-08233 with associated crimp pins and housings. 2.54_SCREWTERM for use with PRT-10571. 3.5mm Screw Terminal footprints for PRT-08084 5mm Screw Terminal footprints for use with PRT-08432
J9 J18 = SparkFun-Connectors:CONN_06: Multi connection point. Often used as Generic Header-pin footprint for 0.1 inch spaced/style header connections On any of the 0.1 inch spaced packages, you can populate with these: Break Away Headers - Straight <https://www.sparkfun.com/products/116> (PRT-00116) Break Away Male Headers - Right Angle <https://www.sparkfun.com/products/553> (PRT-00553) Female Headers <https://www.sparkfun.com/products/115> (PRT-00115) Break Away Headers - Machine Pin <https://www.sparkfun.com/products/117> (PRT-00117) Break Away Female Headers - Swiss Machine Pin <https://www.sparkfun.com/products/743> (PRT-00743) Arduino Stackable Header - 6 Pin <https://www.sparkfun.com/products/9280> (PRT-09280) For SCREWTERMINALS and SPRING TERMINALS visit here: Screw Terimnals on SparkFun.com <https://www.sparkfun.com/search/results?term=Screw+Terminals> (5mm/3.5mm/2.54mm spacing) This device is also useful as a general connection point to wire up your design to another part of your project. Our various solder wires solder well into these plated through hole pads. Hook-Up Wire - Assortment (Stranded, 22 AWG) <https://www.sparkfun.com/products/11375> (PRT-11375) Hook-Up Wire - Assortment (Solid Core, 22 AWG) <https://www.sparkfun.com/products/11367> (PRT-11367) View the entire wire category on our website here <https://www.sparkfun.com/categories/141>; PROD_ID: CONN-08437
JP1 = pinhead:PINHD-1X100: PIN HEADER 100 pol. Grid 2.54mm
R1-R8 = resistor:R-US_: RESISTOR, American symbol
RN1 RN3 = resistor-sil:G07R: SIL RESISTOR; OC_FARNELL: unknown; OC_NEWARK: unknown
RN2 RN4-RN6 = resistor-dil:8R-N: DIL RESISTOR; OC_FARNELL: unknown; OC_NEWARK: unknown
S1 S2 = switch:TL42PO: TINY SWITCH ON - MOM Source: http://www2.produktinfo.conrad.com/datenblaetter/700000-724999/705152-da-01-de-Subminiaturschalter_TL_36YO.pdf
U1 U2 = micro-harris:HD6402: MICROCONTROLLER/MEMORY DEVICE; OC_FARNELL: unknown; OC_NEWARK: unknown
U$1-U$3 U$6 U$10 U$15-U$17 U$20 U$24 = User-Submitted:MM80C97N
U$4 U$18 = User-Submitted:MC14043BCP
U$5 U$19 = User-Submitted:SN75150P
U$7 U$21 = User-Submitted:MC14025BCP
U$8 U$11 U$22 U$25 = User-Submitted:MC14069UBCP
U$9 U$23 = User-Submitted:MC14028BCP
U$12 U$26 = User-Submitted:MC14011BCP
U$13 U$27 = User-Submitted:SN75189AJ
U$14 U$28 = User-Submitted:MSS4200RG